# EAGLE schematic stage_light (EAGLE 6.6.0)
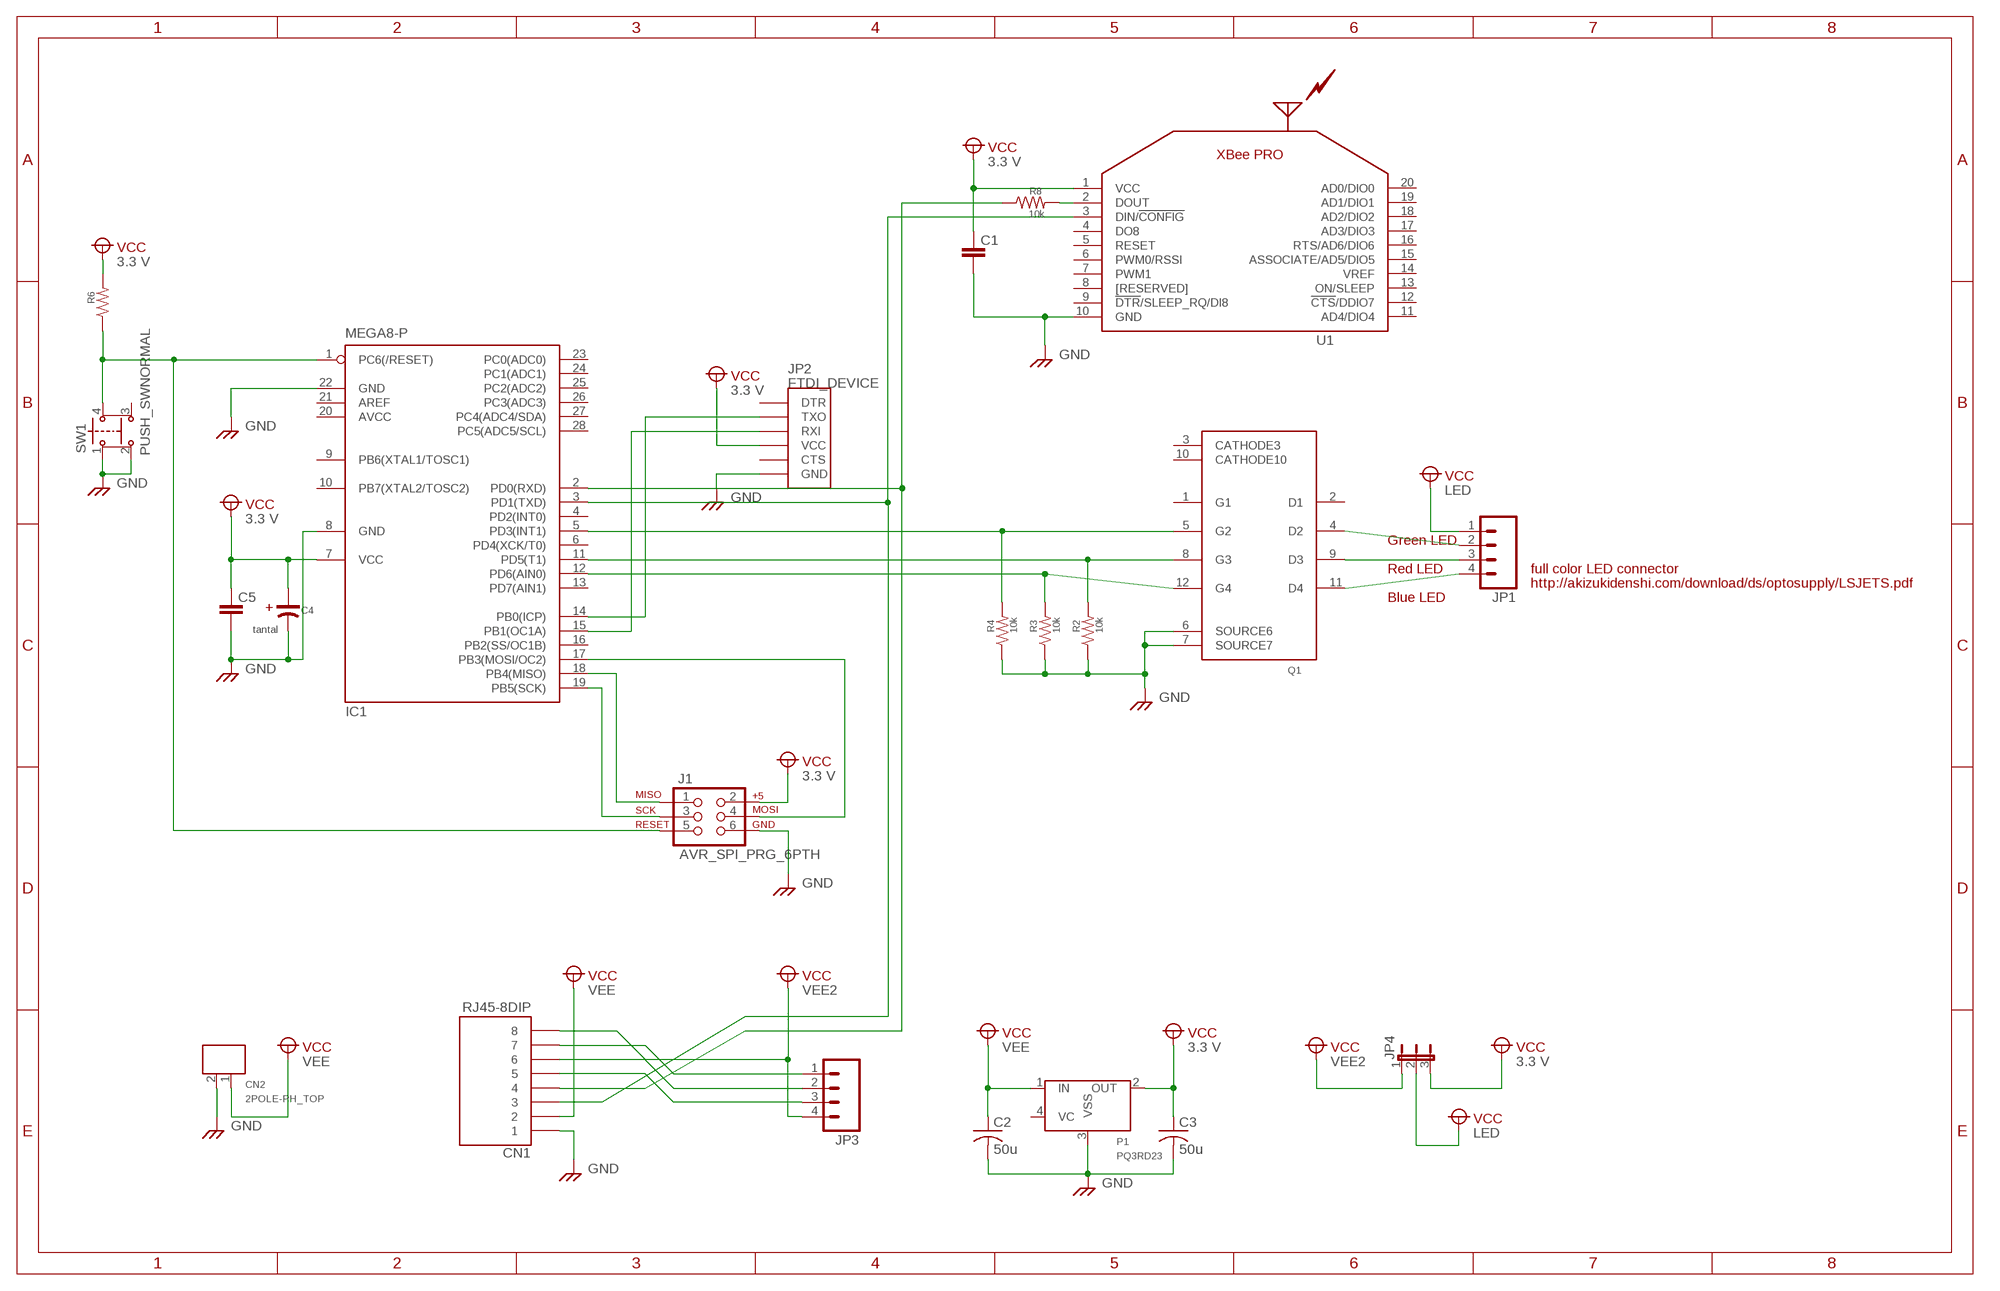
[diagram p0: schematic, sheet 1]

## Parts
C1  GRM18  [1608(1.6*0.8MM)]
C2  50u  C-US025-050X050  [C025-050X050]
C3  50u  C-US025-050X050  [C025-050X050]
C4  CT-100U  [6134(6.1*3.4MM)_POLAR]
C5  GRM18  [1608(1.6*0.8MM)]
CN1  RJ45-8DIP  [AE-RJ-45-LAN-DIP-A]
CN2  2POLE-PH_TOP  [B2B-PH-K-S(2MM_PITCH)]
IC1  MEGA8-P  [DIL28-3]
J1  AVR_SPI_PRG_6PTH  [2X3]
JP1  M04LONGPADS  [1X04_LONGPADS]
JP2  FTDI_DEVICE  [FTDI_DEVICE_SIDE]
JP3  M04PTH  [1X04]
JP4  JP2E  [JP2]
P1  PQ3RD23  [PQ3RD23]
Q1  MP4401  [MP4401]
R2  10k  CHIP1608  [1608(1.6*0.8MM)]
R3  10k  CHIP1608  [1608(1.6*0.8MM)]
R4  10k  CHIP1608  [1608(1.6*0.8MM)]
R6  CHIP1608  [1608(1.6*0.8MM)]
R8  10k  CHIP1608  [1608(1.6*0.8MM)]
SW1  PUSH_SWNORMAL  [PUSH_SW]
U1  XBEE_PROXPPN101BFCN  [XBEE_ON_XPPN101BFCN-RC]

## Nets
GND: C1.P$2 C2.2 C3.2 C4.- C5.P$2 CN1.1 CN2.2 IC1.8(GND) IC1.22(GND) J1.6 JP2.P$6(GND) P1.3(VSS) Q1.6(SOURCE6) Q1.7(SOURCE7) R2.P$3 R3.P$3 R4.P$3 SW1.1 SW1.2 U1.10(GND)
N$1: JP1.3 Q1.9(D3)
N$2: JP1.2 Q1.4(D2)
N$3: IC1.12(PD6(AIN0)) Q1.12(G4) R3.P$4
N$4: IC1.11(PD5(T1)) Q1.8(G3) R2.P$4
N$5: IC1.5(PD3(INT1)) Q1.5(G2) R4.P$4
N$6: JP1.4 Q1.11(D4)
N$7: IC1.14(PB0(ICP)) JP2.P$2(TXO)
N$8: IC1.15(PB1(OC1A)) JP2.P$3(RXI)
N$9: CN1.8 JP3.2
N$10: CN1.5 JP3.3
N$11: CN1.7 JP3.1
N$12: IC1.1(PC6(/RESET)) J1.5 R6.P$3 SW1.4(P3)
N$13: R8.P$4 U1.2(DOUT)
N$15: CN1.4 IC1.2(PD0(RXD)) R8.P$3
N$16: CN1.3 IC1.3(PD1(TXD)) U1.3(DIN/!CONFIG)
N$18: IC1.18(PB4(MISO)) J1.1
N$19: IC1.19(PB5(SCK)) J1.3
N$20: IC1.17(PB3(MOSI/OC2)) J1.4
VCC1: C2.1 CN1.2 CN2.1 P1.1(IN) ; supply symbol labelled VEE
VCC2: C1.P$1 C3.1 C4.+ C5.P$1 IC1.7(VCC) J1.2 JP2.P$4(VCC) JP4.3 P1.2(OUT) R6.P$4 U1.1(VCC) ; supply symbol labelled 3.3 V
VCC3: JP1.1 JP4.2 ; supply symbol labelled LED
VCC4: CN1.6 JP3.4 JP4.1 ; supply symbol labelled VEE2
Unconnected: IC1.4(PD2(INT0)) IC1.6(PD4(XCK/T0)) IC1.9(PB6(XTAL1/TOSC1)) IC1.10(PB7(XTAL2/TOSC2)) IC1.13(PD7(AIN1)) IC1.16(PB2(SS/OC1B)) IC1.21(AREF) IC1.23(PC0(ADC0)) IC1.24(PC1(ADC1)) IC1.25(PC2(ADC2)) IC1.26(PC3(ADC3)) IC1.27(PC4(ADC4/SDA)) IC1.28(PC5(ADC5/SCL)) JP2.P$1(DTR) JP2.P$5(CTS) P1.4(VC) Q1.1(G1) Q1.2(D1) Q1.3(CATHODE3) Q1.10(CATHODE10) SW1.3(P4) U1.4(DO8) U1.5(RESET) U1.6(PWM0/RSSI) U1.7(PWM1) U1.8([RESERVED]) U1.9(!DTR!/SLEEP_RQ/DI8) U1.11(AD4/DIO4) U1.12(!CTS!/DDIO7) U1.13(ON/SLEEP) U1.14(VREF) U1.15(ASSOCIATE/AD5/DIO5) U1.16(RTS/AD6/DIO6) U1.17(AD3/DIO3) U1.18(AD2/DIO2) U1.19(AD1/DIO1) U1.20(AD0/DIO0)

## Notes on the sheet
- Green LED
- Red LED | full color LED connector
- http://akizukidenshi.com/download/ds/optosupply/LSJETS.pdf
- Blue LED

## Power pins joined to a net without a drawn wire
AVCC: IC1.20(AVCC)

## Library data of the parts
C1 C5 = Capasitor:GRM: GRM series chip capasitor producted by muRata.Co
C2 C3 = rcl:C-US: CAPACITOR, American symbol
C4 = Capasitor:CT-: CT series chip capasitor producted by Linkman.Co
CN1 = Connector-etc:RJ45-8: RJ45 Jack Simple RJ45, 8-pin connection - connector for common Cat5, Cat5e, and Cat6 Ethernet cables. Footprint not yet proven in production. Connector sku is PRT-00643; Breakout PCB sku is BOB-00716.
CN2 = Connector-Housing:2POLE
IC1 = atmel:MEGA8-P: MICROCONTROLLER 8 Kbytes FLASH, 1 kbytes SRAM, 512 bytes EEPROM, USART, 4-channel 10 bit ADC, 2-channel 8 bit ADC Pin compatible with Atmega48, ATMega88, ATMega168 Source: avr.lbr; OC_FARNELL: unknown; OC_NEWARK: unknown
J1 = SparkFun-Connectors:AVR_SPI_PRG_6: AVR ISP 6 Pin This is the reduced ISP connector for AVR programming. Common on Arduino. This footprint will take up less PCB space and can be used with a 10-pin to 6-pin adapter such as SKU: BOB-08508 **Special note about "TEST_POINT" package. The stop mask is on the top side, so if you want your programming test points to be on the bottom of your board, make sure to place this package on the bottom side of the board. This also ensure that the orientation to program from the bottom side will be correct.
JP1 JP3 = SparkFun-Connectors:M04: Header 4 Standard 4-pin 0.1" header. Use with straight break away headers (SKU : PRT-00116), right angle break away headers (PRT-00553), swiss pins (PRT-00743), machine pins (PRT-00117), and female headers (PRT-00115). Molex polarized connector foot print use with SKU : PRT-08231 with associated crimp pins and housings. 1MM SMD Version SKU: PRT-10208
JP2 = SparkFun-Connectors:FTDI_DEVICE: Connector which mates to FTDI basic or FTDI cable.
JP4 = Jumper:JP2E: JUMPER
P1 = Voltage Regulator:PQ3RD23: PQ3RD23 is a kind of voltage regulator with power control pin by SHARP. Output ON: control pin is High or Open (photo is from Akituki) ------------------------------------------------------------------- Datasheet: here <http://www.sharp.co.jp/products/device/lineup/data/pdf/datasheet/pq05rd21_j.pdf> Shop: 秋月電子通商 <http://akizukidenshi.com/catalog/g/gI-01177/>
Q1 = FET n-ch:MP4401
R2-R4 R6 R8 = Resistor:CHIP: 1608(1.6*0.8) size chip resistor
SW1 = Switch:PUSH_SW
U1 = ZigBee Modules:XBEE_PRO: XBee , ZigBee transceiver Producted by XBee ; Digi-Key.Co